# Altium schematic sheet part_1.SchDoc
size A4; SheetNumber: 1; SheetTotal: 2; V: 10 V
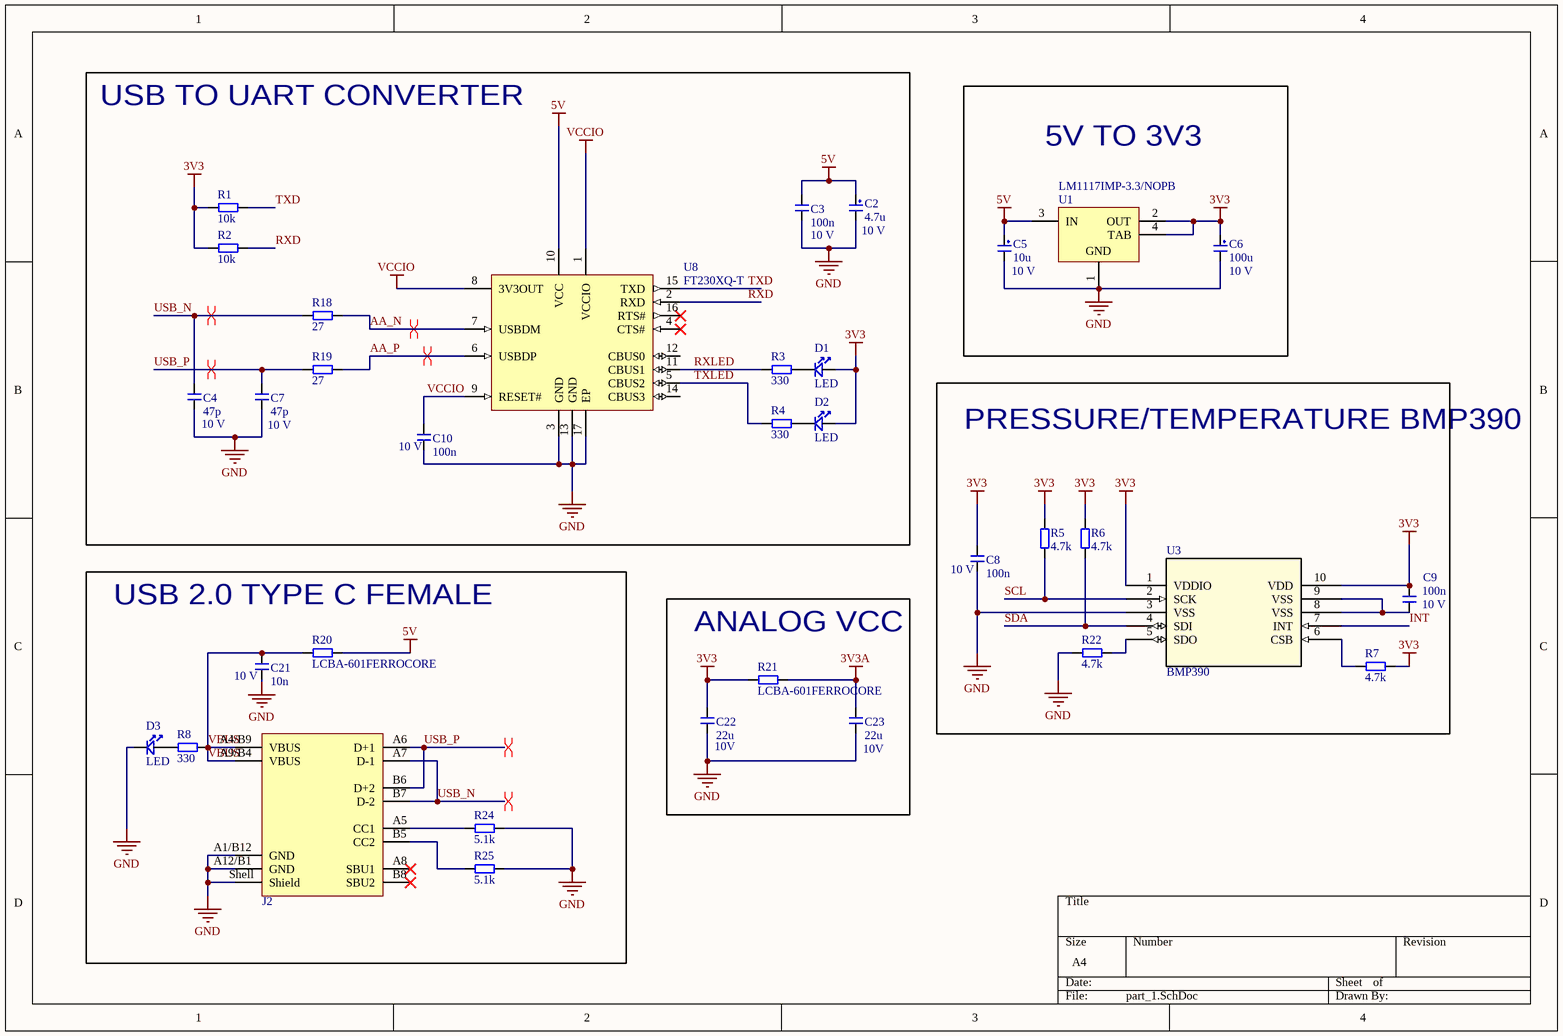
[diagram p0: part_1.SchDoc]

## Parts
C2  4.7u  VOLTAGE: 10 V  [TANT_A]
C3  100n  V: 10 V  [0603]
C4  47p  VOLTAGE: 10 V  [0603]
C5  10u  VOLTAGE: 10 V  [TANT_A]
C6  100u  VOLTAGE: 10 V  [TANT_A]
C7  47p  VOLTAGE: 10 V  [0603]
C8  100n  V: 10 V  [0603]
C9  100n  V: 10 V  [0603]
C10  100n  V: 10 V  [0603]
C21  10n  VOLTAGE: 10 V  [0603]
C22  22u  V: 10V  [0603]
C23  22u  V: 10V  [0603]
D1  LED  [Dioda_0805]
D2  LED  [Dioda_0805]
D3  LED  [Dioda_0805]
J2  629722000214  [629722000214]  (value not drawn)
R1  10k  [0603]
R2  10k  [0603]
R3  330  [0603]
R4  330  [0603]
R5  4.7k  [0603]
R6  4.7k  [0603]
R7  4.7k  [0603]
R8  330  [0603]
R18  27  [0603]
R19  27  [0603]
R20  LCBA-601FERROCORE  [0402]
R21  LCBA-601FERROCORE  [0402]
R22  4.7k  [0603]
R24  5.1k  [0402]
R25  5.1k  [0402]
U1  LM1117IMP-3.3/NOPB  [DCY0004A_N]
U3  BMP390  [10LGA_2X2X0p75_BOS]
U8  FT230XQ-T  [QFN-16_N]

## Blocks framed on the sheet
USB TO UART CONVERTER: C2-C4 C7 C10 D1 D2 R1-R4 R18 R19 U8
5V TO 3V3: C5 C6 U1
PRESSURE/TEMPERATURE BMP390: C8 C9 R5-R7 R22 U3
USB 2.0 TYPE C FEMALE: C21 D3 J2 R8 R20 R24 R25
ANALOG VCC: C22 C23 R21

## Nets
3V3: C6.1 C8.2 C9.2 C22.2 D1.2 D2.2 R1.2 R2.2 R5.2 R6.2 R7.2 R21.1 U1.2(OUT) U1.4(TAB) U3.1(VDDIO) U3.10(VDD)
3V3A: C23.2 R21.2
5V: C2.1 C3.2 C5.1 R20.2 U1.3(IN) U8.10(VCC)
GND: C2.2 C3.1 C4.1 C5.2 C6.2 C7.1 C8.1 C10.1 C21.1 C22.1 C23.1 D3.1 J2.A1/B12(GND) J2.A12/B1(GND) J2.Shell(Shield) R22.1 R24.2 R25.2 U1.1(GND) U3.3(VSS) U8.3(GND) U8.13(GND) U8.17(EP)
VCCIO: C10.2 U8.1(VCCIO) U8.8(3V3OUT) U8.9(RESET#)
AA_N: R18.1 U8.7(USBDM)
AA_P: R19.1 U8.6(USBDP)
INT: U3.7(INT)
RXD: R2.1 U8.2(RXD)
RXLED: R3.1 U8.11(CBUS1)
SCL: R5.1 U3.2(SCK)
SDA: R6.1 U3.4(SDI)
TXD: R1.1 U8.15(TXD)
TXLED: R4.1 U8.5(CBUS2)
USB_N: C4.2 J2.A7(D-1) J2.B7(D-2) R18.2
USB_P: C7.2 J2.A6(D+1) J2.B6(D+2) R19.2
VBUS: C21.2 J2.A4/B9(VBUS) J2.A9/B4(VBUS) R8.1 R20.1
NetC9_1: C9.1 U3.8(VSS) U3.9(VSS)
NetD1_1: D1.1 R3.2
NetD2_1: D2.1 R4.2
NetD3_2: D3.2 R8.2
NetJ2_A5: J2.A5(CC1) R24.1
NetJ2_B5: J2.B5(CC2) R25.1
NetR7_1: R7.1 U3.6(CSB)
NetR22_2: R22.2 U3.5(SDO)

Not connected (* = marked no-connect by the designer): J2 A8(SBU1)* B8(SBU2)*; U8 4(CTS#)* 12(CBUS0) 14(CBUS3) 16(RTS#)*

## Layout directives
differential pair; differential pair class 90ohm: USB_N, USB_P
differential pair: AA_N, AA_P

## Library data of the parts
C2 C5 C6 = CapP: kondensator tantalowy
C3 C4 C7-C10 C22 C23 = CapN: kondensator ceramiczny
  C3 C8-C10: VOLTAGE: 10 V
  C4 C7: V: 10 V
C21 = CapN: kondensator ceramiczny; Parameter 1: 10V
D1-D3 = Dioda_LED: Dioda LED SMD
J2 = 629722000214: WR-COM USB 2.0 Type C Receptacle Horizontal SMT; Manufacturer: Wurth Elektronik; Match Code: WR-USB; Interface Type: Type C; Number of Ports: 1; Rated Current: 5A; Working Voltage: 20V (DC); Manufacturer Part Number: 629722000214; Category: Input/Output Connectors; ComponentLink1Description: Website Link; ComponentLink1URL: https://www.we-online.com/redexpert/article/629722000214?ad; ComponentLink2Description: Datasheet Link; ComponentLink2URL: https://www.we-online.com/redexpert/spec/629722000214?ad; Mount: Surface Mount; Operating Temperature Max: 85°C; Operating Temperature Min: -40°C; Packaging: Tape and Reel; Application: USB 2.0; Gender: Receptacle; Number of Pins: 16; Orientation: Horizontal
R1-R8 R18-R22 R24 R25 = Res: Rezystor SMD
U1 = CMP-0062-01631-4: 800mA Low-Dropout Linear Regulator, 4-pin SOT-223, Pb-Free; Manufacturer: Texas Instruments; PackageTopMarking: XYTT*N05B; PowerWise: N; High-Reliability: Y; CompType: LDO IC; Code_IPC: SOT223-4; PackageReference: DCY0004A; PinCount: 4; PackageDescription: Molded SOT-223, 6.50 x 3.56 x 1.6mm Body, 4 Lead, 2.3mm Pitch; PartNumber: LM1117IMP-3.3/NOPB; RoHS: Y; ComponentLink1Description: Datasheet URL; Code_JEDEC: TO-261-AA; ComponentLink1URL: http://www.ti.com/general/docs/lit/getliterature.tsp?genericPartNumber=LM1117-N&fileType=pdf
U3 = BMP390: No Description Available; Mfr_Name: Bosch Sensortec; RefDes: RefDes; Type: Type
U8 = FT230XQ-T: USB to Basic UART Interface Chip, UHCI/OHCI/EHCI Compatible, USB 2.0 Compatible, -40 to +85 degC, 16-Pin QFN, Pb-Free, Tray; Manufacturer: FTDI; DatasheetVersion: ver 1.2, Feb-2013; PackageVersion: Feb-13; PackageReference: QFN-16; PackageDescription: 16-Pin Quad Flat No-Lead, 4x4 mm Body, 0.65 mm Pitch; Code_JEDEC: MO-220WGGC; PartNumber: FT230XQ-T; ComponentLink1Description: Manufacturer URL; ComponentLink1URL: http://www.ftdichip.com/; ComponentLink2Description: Datasheet; ComponentLink2URL: http://www.ftdichip.com/Support/Documents/DataSheets/ICs/DS_FT230X.pdf; ComponentLink3Description: FT230X Product Page; ComponentLink3URL: www.ftdichip.com/Products/ICs/FT230X.html